# EasyEDA Pro project ProPrj_Inverted_MAML_6x6_2026-08-12.epro, schematic matrix8
Create Date: 2026-06-14; Page Name: P1; Project Name: Inverted_MAML_6x6; Schematic Name: Schematic1; Update Date: 2026-06-14; Company: EasyEDA.com; Page Size: A4; Version: V1.0
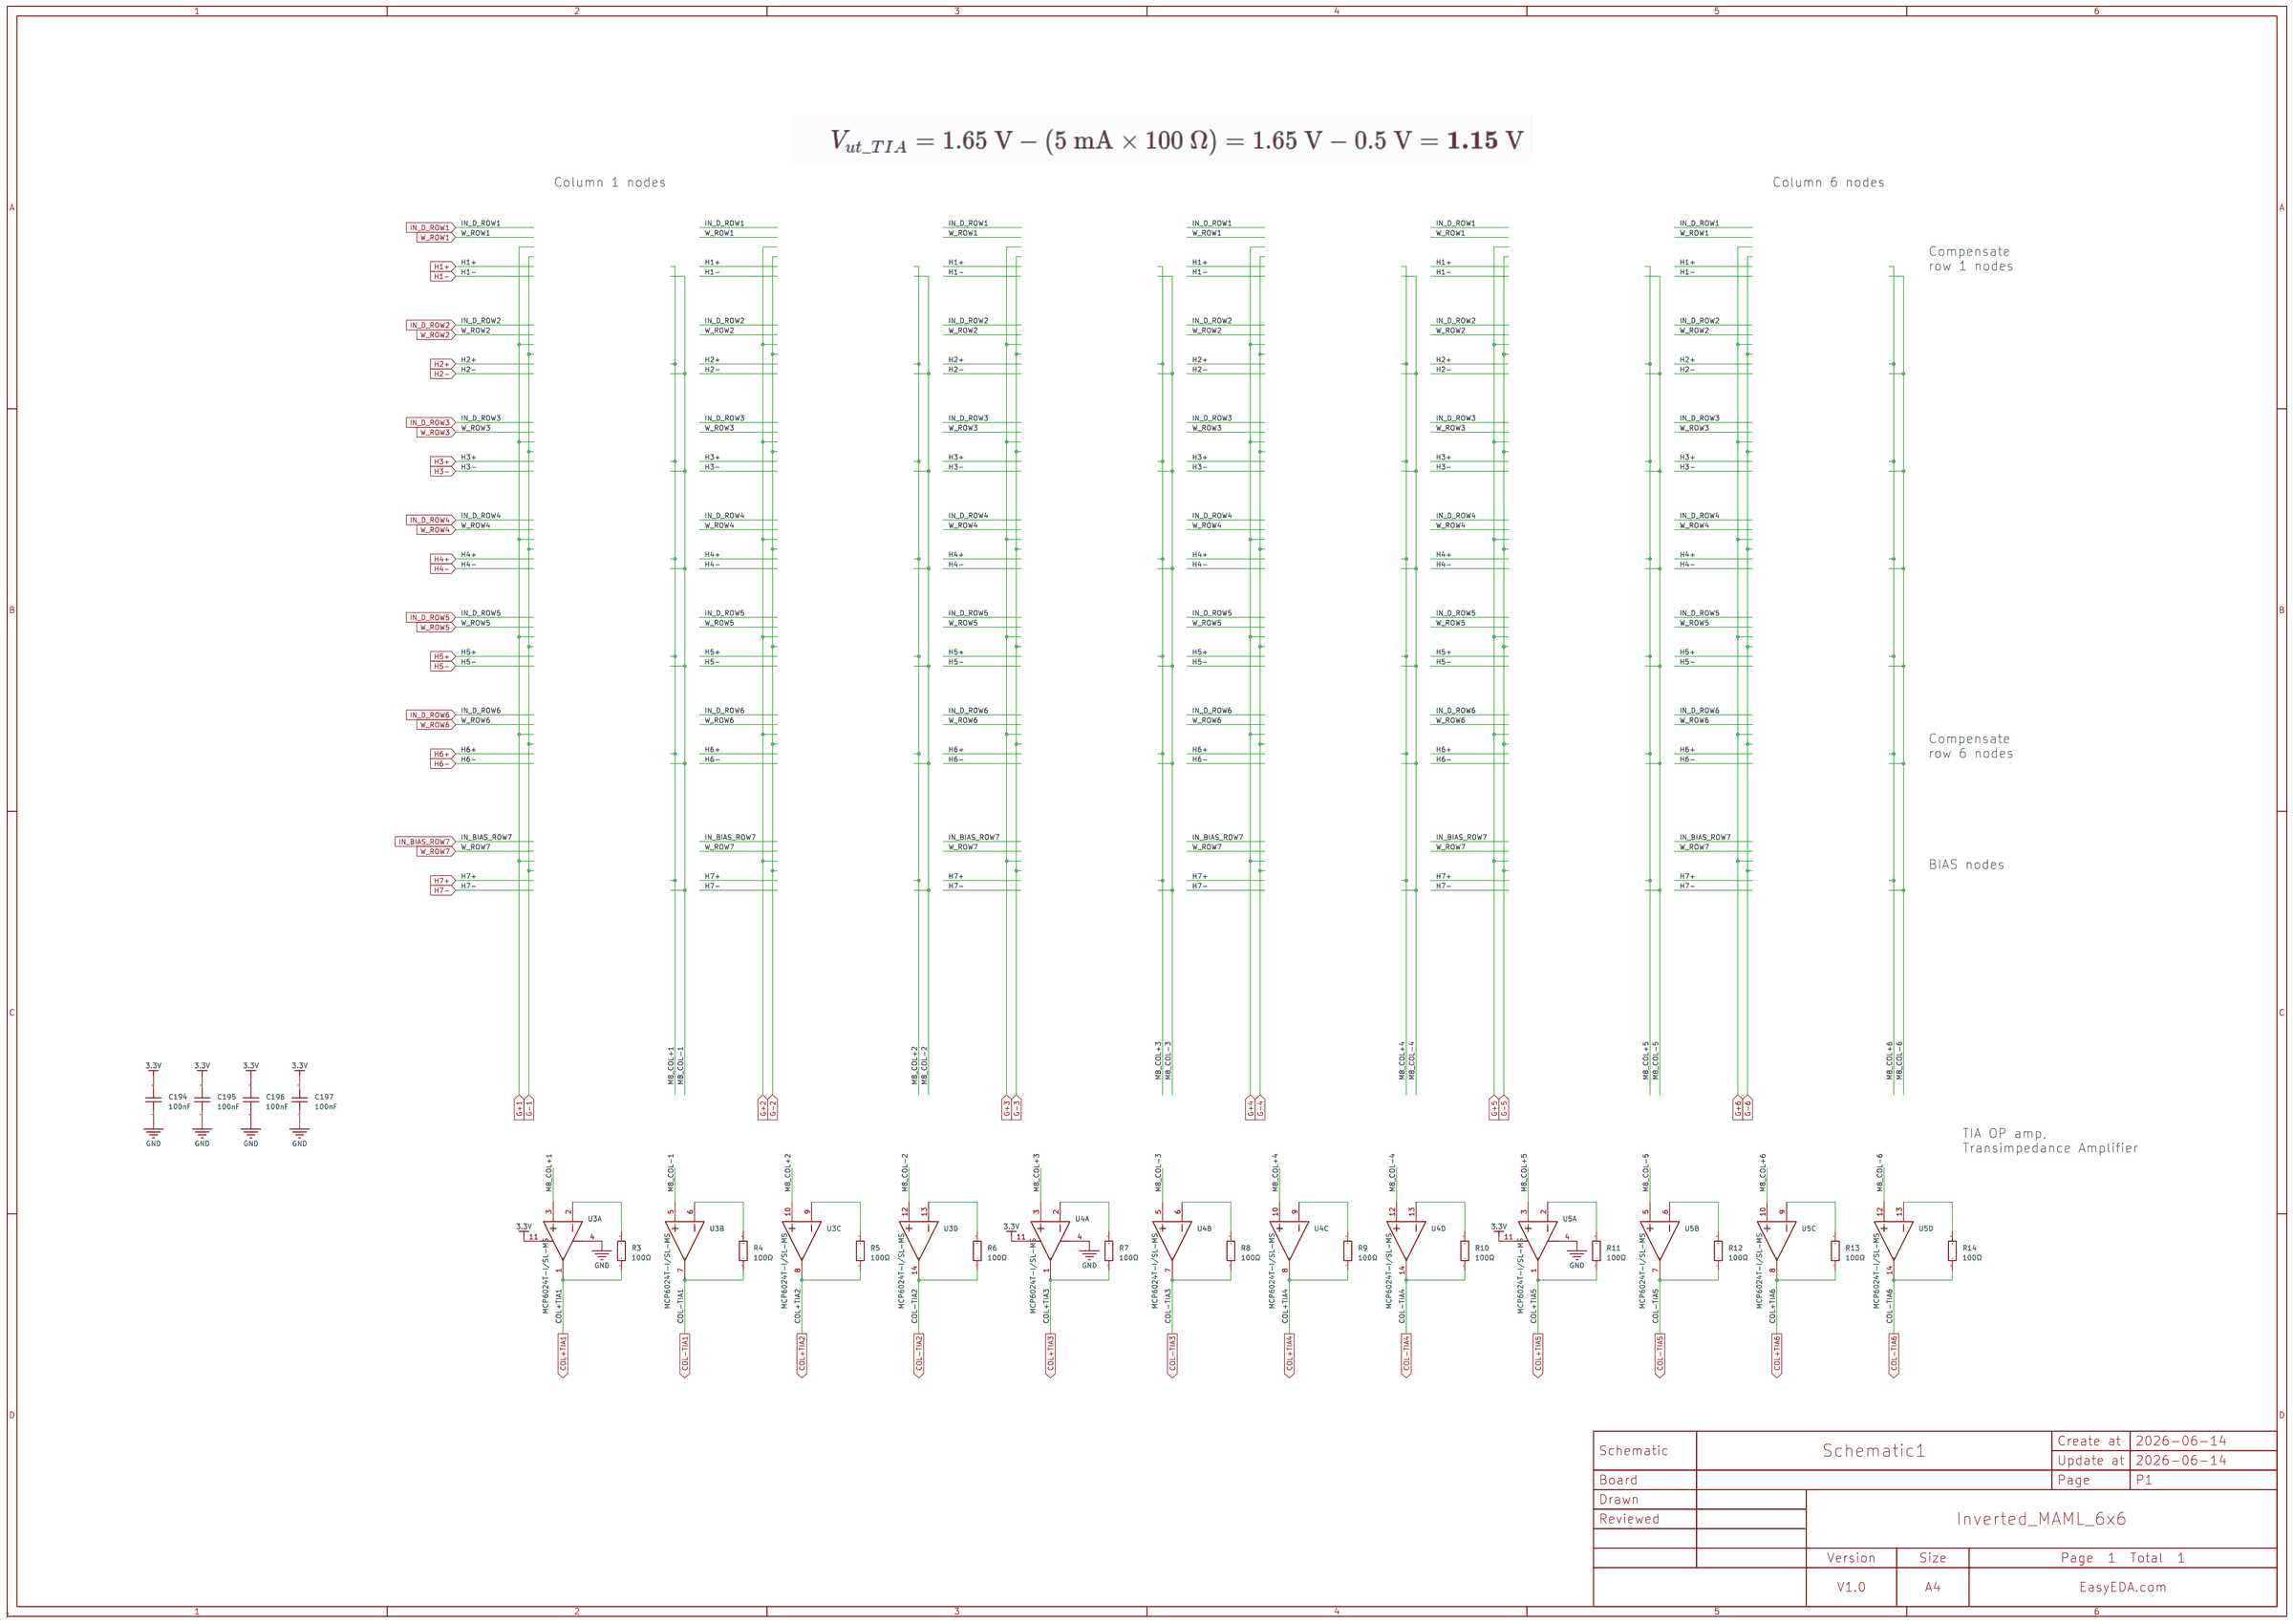
[diagram p8: schematic sheet]

## Parts
C194  100nF  [C0402]
C195  100nF  [C0402]
C196  100nF  [C0402]
C197  100nF  [C0402]
CBB1  -
CBB2  -
CBB3  -
CBB4  -
CBB5  -
CBB6  -
CBB7  -
CBB8  -
CBB9  -
CBB10  -
CBB11  -
CBB12  -
CBB13  -
CBB14  -
CBB15  -
CBB16  -
CBB17  -
CBB18  -
CBB19  -
CBB20  -
CBB21  -
CBB22  -
CBB23  -
CBB24  -
CBB25  -
CBB26  -
CBB27  -
CBB28  -
CBB29  -
CBB30  -
CBB31  -
CBB32  -
CBB33  -
CBB34  -
CBB35  -
CBB36  -
CBB37  -
CBB38  -
CBB39  -
CBB40  -
CBB41  -
CBB42  -
R3  100Ω  [R0402]
R4  100Ω  [R0402]
R5  100Ω  [R0402]
R6  100Ω  [R0402]
R7  100Ω  [R0402]
R8  100Ω  [R0402]
R9  100Ω  [R0402]
R10  100Ω  [R0402]
R11  100Ω  [R0402]
R12  100Ω  [R0402]
R13  100Ω  [R0402]
R14  100Ω  [R0402]
U3  MCP6024T-I/SL-MS  [SOIC-14_L8.7-W3.9-P1.27-LS6.0-BL-1]  (sections 1,2,3,4)
U4  MCP6024T-I/SL-MS  [SOIC-14_L8.7-W3.9-P1.27-LS6.0-BL-1]  (sections 1,2,3,4)
U5  MCP6024T-I/SL-MS  [SOIC-14_L8.7-W3.9-P1.27-LS6.0-BL-1]  (sections 1,2,3,4)

## Library data of the parts
C194-C197 = CL05B104KO5NNNC: Capacitance:100nF Tolerance:±10% Tolerance:±10% Voltage Rating:16V Temperature Coefficient:X7R; LCSC Part Name: 100nF ±10% 16V; Supplier Part: C1525; Manufacturer: SAMSUNG(三星); Supplier Footprint: 0402; JLCPCB Part Class: Basic Part; Datasheet: https://item.szlcsc.com/datasheet/CL05B104KO5NNNC/1877.html; Supplier: LCSC; Tolerance: ±10%; Voltage Rating: 16V; Temperature Coefficient: X7R
R3-R14 = 0402WGF1000TCE: Type:Thick Film Resistors Resistance: Tolerance:±1% Tolerance:±1% Power(Watts): Overload Voltage (Max): Temperature Coefficient:±200ppm/℃ Temperature Coefficient:±200ppm/℃ Operating Temperature Range:-55℃~+155℃ Operating Temperature Range:-55℃~+155℃; LCSC Part Name: 100Ω ±1% 62.5mW 厚膜电阻; Supplier Part: C25076; Manufacturer: UNI-ROYAL(厚声); Supplier Footprint: 0402; JLCPCB Part Class: Basic Part; Datasheet: https://atta.szlcsc.com/upload/public/pdf/source/20200306/C422600_1E6D84923E4A46A82E41ADD87F860B5C.pdf; Supplier: LCSC; Type: Thick Film Resistors; Tolerance: ±1%; Temperature Coefficient: ±200ppm/℃; Operating Temperature Range: -55℃~+155℃
U3-U5 = MCP6024T-I/SL-MS: Supplier Part: C54539958; Manufacturer: MSKSEMI(美森科); Supplier Footprint: SOP-14; JLCPCB Part Class: Extended Part; Datasheet: https://item.szlcsc.com/datasheet/MCP6024T-I%252FSL-MS/57895720.html; Supplier: LCSC

## Nets
3.3V: C194.2 C195.2 C196.2 C197.2 U3.11(V-) U4.11(V-) U5.11(V-)
GND: C194.1 C195.1 C196.1 C197.1 U3.4(V+) U4.4(V+) U5.4(V+)
COL+TIA1: R3.1 U3.1(OUT1)
COL+TIA2: R5.1 U3.8(OUT3)
COL+TIA3: R7.1 U4.1(OUT1)
COL+TIA4: R9.1 U4.8(OUT3)
COL+TIA5: R11.1 U5.1(OUT1)
COL+TIA6: R13.1 U5.8(OUT3)
COL-TIA1: R4.1 U3.7(OUT2)
COL-TIA2: R6.1 U3.14(OUT4)
COL-TIA3: R8.1 U4.7(OUT2)
COL-TIA4: R10.1 U4.14(OUT4)
COL-TIA5: R12.1 U5.7(OUT2)
COL-TIA6: R14.1 U5.14(OUT4)
G+1: CBB1.(OUT_COL-) CBB2.(OUT_COL-) CBB3.(OUT_COL-) CBB4.(OUT_COL-) CBB5.(OUT_COL-) CBB6.(OUT_COL-) CBB7.(OUT_COL-) CBB8.(OUT_COL-) CBB9.(OUT_COL-) CBB10.(OUT_COL-) CBB11.(OUT_COL-) CBB12.(OUT_COL-) CBB13.(OUT_COL-) CBB14.(OUT_COL-) CBB15.(OUT_COL-) CBB16.(OUT_COL-) CBB17.(OUT_COL-) CBB18.(OUT_COL-) CBB19.(OUT_COL-) CBB20.(OUT_COL-) CBB21.(OUT_COL-) CBB22.(OUT_COL-) CBB23.(OUT_COL-) CBB24.(OUT_COL-) CBB25.(OUT_COL-) CBB26.(OUT_COL-) CBB27.(OUT_COL-) CBB28.(OUT_COL-) CBB29.(OUT_COL-) CBB30.(OUT_COL-) CBB31.(OUT_COL-) CBB32.(OUT_COL-) CBB33.(OUT_COL-) CBB34.(OUT_COL-) CBB35.(OUT_COL-) CBB36.(OUT_COL-) CBB37.(OUT_COL-) CBB38.(OUT_COL-) CBB39.(OUT_COL-) CBB40.(OUT_COL-) CBB41.(OUT_COL-) CBB42.(OUT_COL-) U3.3(IN1+) U3.5(IN2+) U3.10(IN3+) U3.12(IN4+) U4.3(IN1+) U4.5(IN2+) U4.10(IN3+) U4.12(IN4+) U5.3(IN1+) U5.5(IN2+) U5.10(IN3+) U5.12(IN4+)
Net-(R3-2): R3.2 U3.2(IN1-)
Net-(R4-2): R4.2 U3.6(IN2-)
Net-(R5-2): R5.2 U3.9(IN3-)
Net-(R6-2): R6.2 U3.13(IN4-)
Net-(R7-2): R7.2 U4.2(IN1-)
Net-(R8-2): R8.2 U4.6(IN2-)
Net-(R9-2): R9.2 U4.9(IN3-)
Net-(R10-2): R10.2 U4.13(IN4-)
Net-(R11-2): R11.2 U5.2(IN1-)
Net-(R12-2): R12.2 U5.6(IN2-)
Net-(R13-2): R13.2 U5.9(IN3-)
Net-(R14-2): R14.2 U5.13(IN4-)

## Notes on the sheet
- Column 1 nodes
- Column 6 nodes
- Compensate
  row 1 nodes
- Compensate
  row 6 nodes
- BIAS nodes
- TIA OP amp,
  Transimpedance Amplifier
